# EAGLE design varistor (EAGLE 6.5.0)
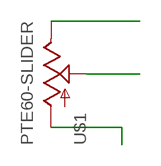
[diagram p0: schematic, sheet 1]

## Parts
U$1  PTE60-SLIDER  [SLIDER]

## Nets
N$1: U$1.1(A)
N$2: U$1.2(S)
N$3: U$1.3(E)

## Library data of the parts
U$1 = lt3092:PTE60-SLIDER

## Board
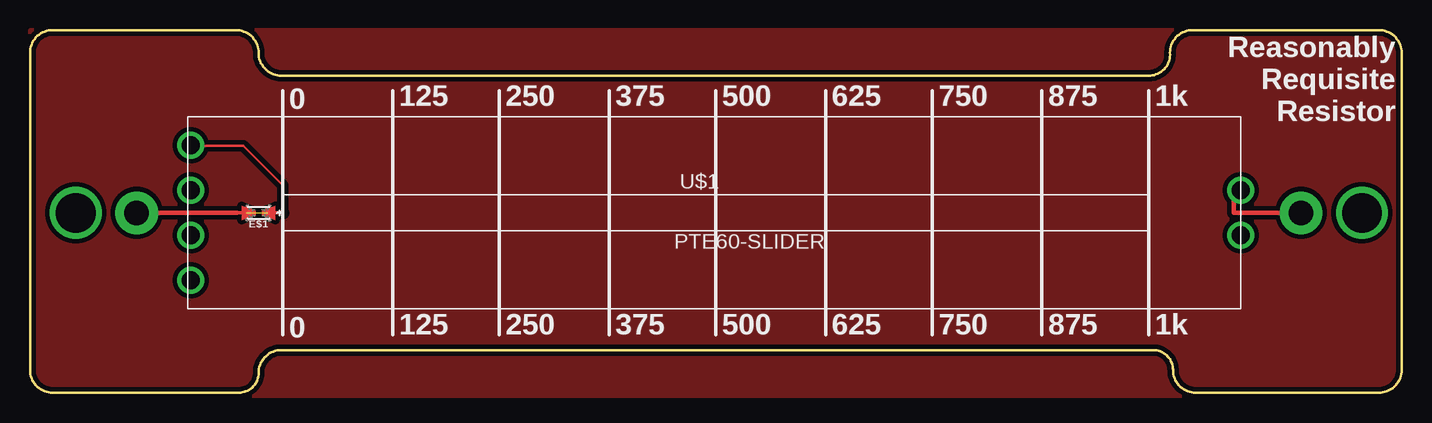
[diagram p1: board, top side]
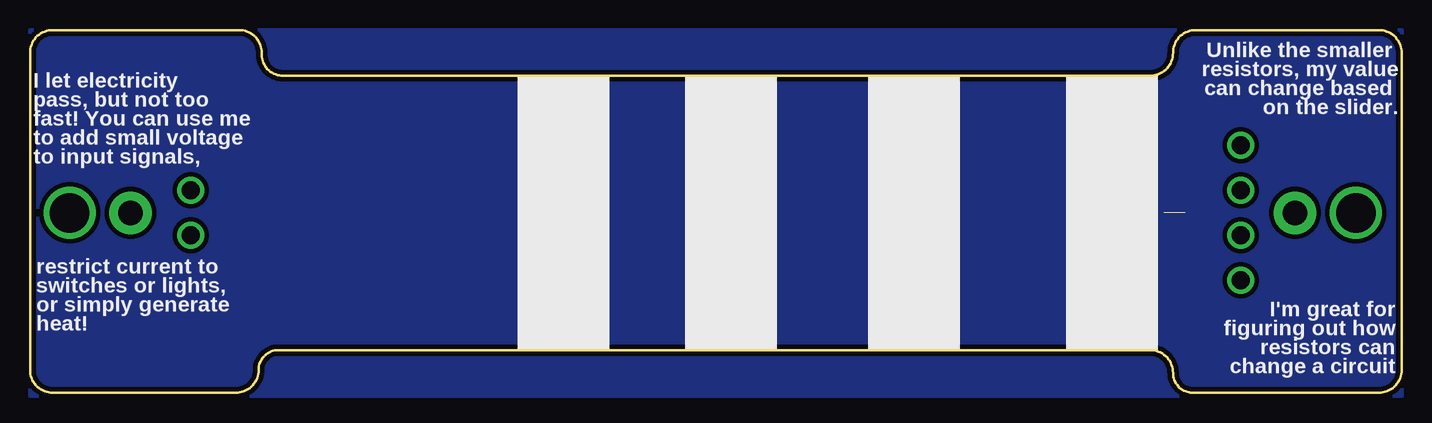
[diagram p2: board, bottom side, seen from below]

Size 114.3 x 30.23 mm. Coordinates in mm from the lower left corner, seen from the top.
Outline: 93.6,3.56 20.95,3.56 arc90 19.05,1.65 arc-90 17.4,0 1.91,0 arc-90 0,1.91 0,28.32 arc-90 1.91,30.23 17.14,30.23 arc-90 19.05,28.32 arc90 20.95,26.42 93.34,26.42 arc90 95,28.32 arc-90 96.9,30.23 112.39,30.23 arc-90 114.3,28.32 114.3,1.91 arc-90 112.39,0 97.16,0 arc-90 95.25,1.91 arc90 93.6,3.56
Copper layers (1*16): Top 0.035mm / dielectric 1.5mm / Bottom 0.035mm
Design rules "default *": minimum track width 10mil, minimum drill 0.6mm, track to track 8mil, track to pad 8mil, pad to pad 8mil, via to via 8mil, smd to smd 8mil, copper to edge 15mil, drill to drill 8mil, minimum pad ring 10mil, minimum via ring 8mil, stop-mask expansion 4mil, vias tented up to drill 0mil, thermal gap 10mil

### Footprints (pad centres in the part's own frame; a part is rotated, then mirrored left to right if it is on the bottom)
0402-0603-0805-UNIVERSAL = smd 0.254 x 0.254: + -0.762,0; - 0.762,0
SLIDER = drill 1.5 pad 2: 1 -43.75,1.875; 1A -43.75,-1.875; 2 -43.75,5.625; 2A -43.75,-5.625; 3 43.75,1.875; 3A 43.75,-1.875

### Placement (x,y rotation side)
E$1  [0402-0603-0805-UNIVERSAL]  19.05,14.99 180 top
U$1  57.15,14.99 0 top

### Tracks (layer width: path | path; a pad name or v marks a point on that pad's centre or on a via)
N$4
  pour Bottom (isolate 0.381, rank 6): 0,30.23 0,-0.25 114.3,-0.25 114.3,30.23
S$1  (via drill 3.3)
  other vias: 3.81,14.99
S$2  (via drill 3.3)
  other vias: 111,14.99
S$3  (via drill 2.03 pad 3.56)  (1 unrouted)
  Top 0.203: 21.08,14.99 21.08,17.27 17.78,20.57 13.46,20.57
  Top 0.305: 17.27,14.99 18.03,14.99 | 21.08,14.99 19.81,14.99
  Top 0.381: v8.89,14.99 17.27,14.99
S$4  (via drill 2.03 pad 3.56)
  Top 0.203: 100.33,16.76 100.84,16.76
  Top 0.381: v105.92,14.99 100.33,14.99 100.33,16.76
S$5
  pour Top (isolate 0.381): 0,30.23 0,1.78 arc90 1.78,-0.25 113.03,-0.25 arc90 114.3,1.27 114.3,28.45 arc90 112.52,30.23

### Text on the board
tPlace: Reasonably / Requisite / Resistor | 125 | 250 | 375 | 500 | 625 | 750 | 875 | 1k | 0 | 125 | 250 | 375 | 500 | 625 | 750 | 875 | 1k | 0
bPlace: Unlike the smaller / resistors, my value / can change based / on the slider. | I let electricity / pass, but not too / fast! You can use me / to add small voltage / to input signals, | restrict current to / switches or lights, / or simply generate / heat! | I'm great for / figuring out how / resistors can / change a circuit
bStop: ? | ? | ? | ? | ? | ? | ? | ? | ? | ? | ? | ? | ? | ? | ? | ? | ? | ? | ? | ? | ? | ? | ? | ?